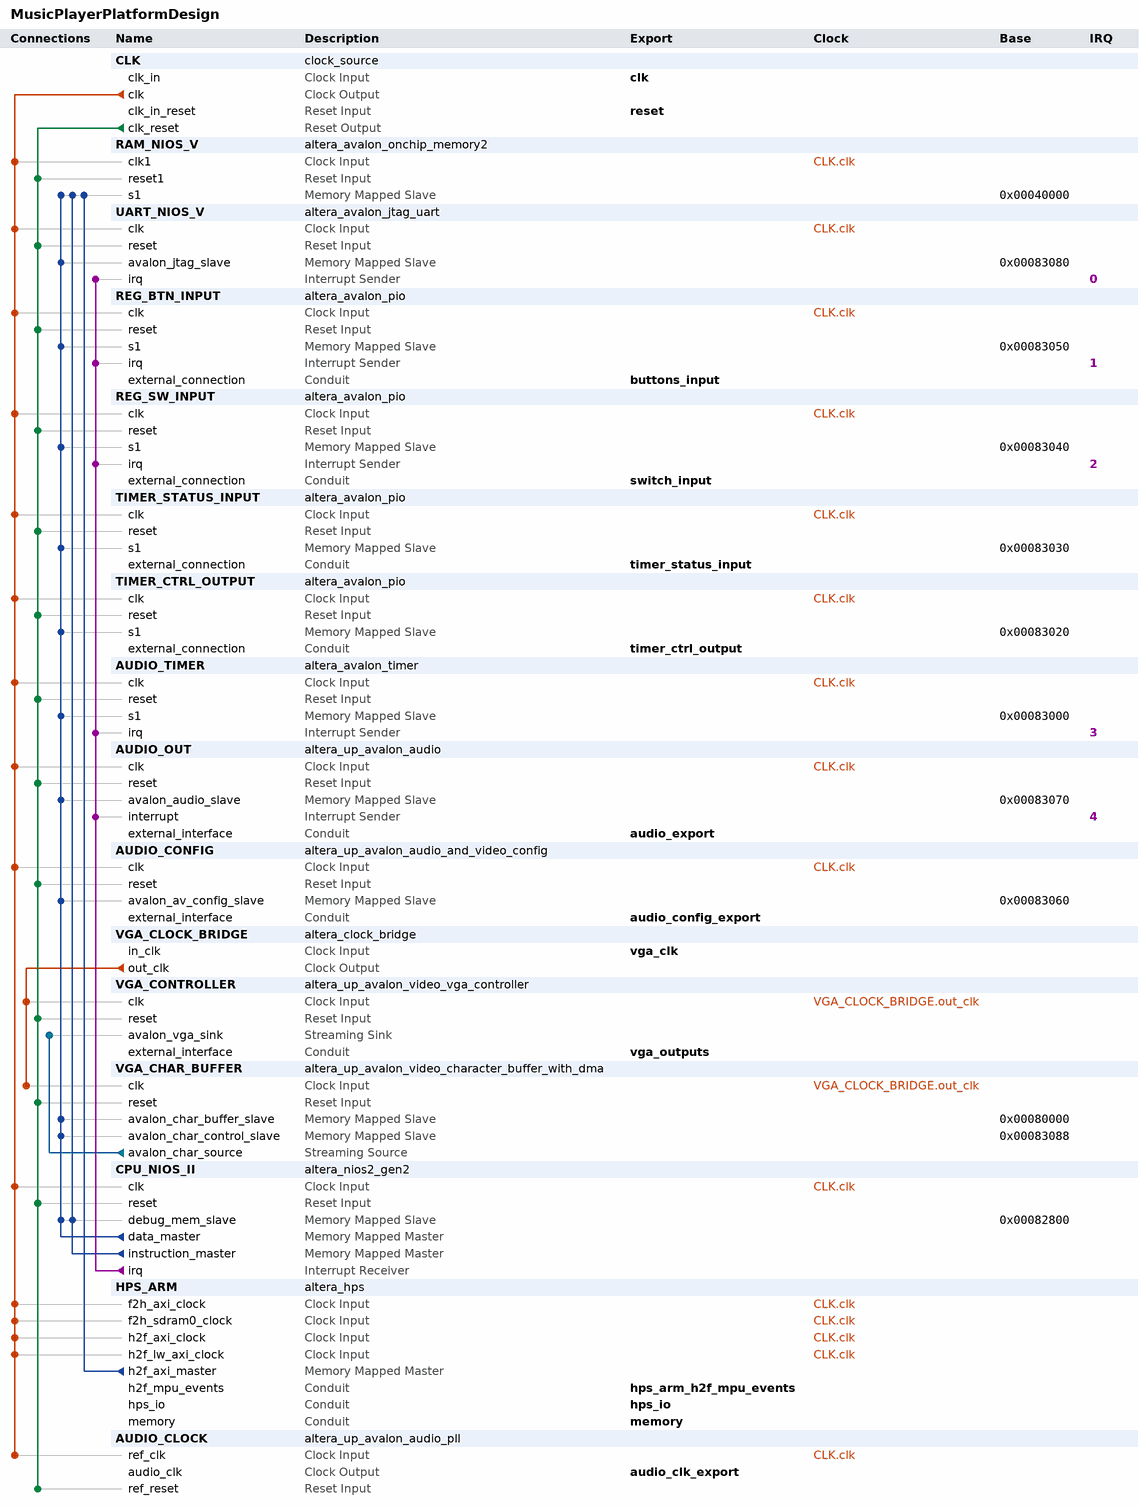
[diagram p0: system contents]
# Platform Designer (Qsys) system MusicPlayerPlatformDesign, Cyclone V 5CSEMA5F31C6
# Parameters at their usual value, and those the tool derives, are not listed.
package require -exact qsys 22.1
create_system MusicPlayerPlatformDesign
set_project_property DEVICE_FAMILY {Cyclone V}
set_project_property DEVICE 5CSEMA5F31C6

add_instance CLK clock_source 22.1
set_instance_parameter_value CLK clockFrequency 50000000

add_instance RAM_NIOS_V altera_avalon_onchip_memory2 22.1
set_instance_parameter_value RAM_NIOS_V dataWidth 32
set_instance_parameter_value RAM_NIOS_V dualPort false
set_instance_parameter_value RAM_NIOS_V initMemContent true
set_instance_parameter_value RAM_NIOS_V initializationFileName onchip_mem.hex
set_instance_parameter_value RAM_NIOS_V memorySize 262144

add_instance UART_NIOS_V altera_avalon_jtag_uart 22.1
set_instance_parameter_value UART_NIOS_V simInteractiveOptions NO_INTERACTIVE_WINDOWS

add_instance REG_BTN_INPUT altera_avalon_pio 22.1
set_instance_parameter_value REG_BTN_INPUT direction Input
set_instance_parameter_value REG_BTN_INPUT generateIRQ true
set_instance_parameter_value REG_BTN_INPUT width 4

add_instance REG_SW_INPUT altera_avalon_pio 22.1
set_instance_parameter_value REG_SW_INPUT direction Input
set_instance_parameter_value REG_SW_INPUT generateIRQ true
set_instance_parameter_value REG_SW_INPUT width 1

add_instance TIMER_STATUS_INPUT altera_avalon_pio 22.1
set_instance_parameter_value TIMER_STATUS_INPUT direction Input
set_instance_parameter_value TIMER_STATUS_INPUT width 2

add_instance TIMER_CTRL_OUTPUT altera_avalon_pio 22.1
set_instance_parameter_value TIMER_CTRL_OUTPUT direction Output
set_instance_parameter_value TIMER_CTRL_OUTPUT width 2

add_instance AUDIO_TIMER altera_avalon_timer 22.1
set_instance_parameter_value AUDIO_TIMER period 1
set_instance_parameter_value AUDIO_TIMER periodUnits MSEC

add_instance AUDIO_OUT altera_up_avalon_audio 18.0
set_instance_parameter_value AUDIO_OUT audio_in false
set_instance_parameter_value AUDIO_OUT avalon_bus_type {Memory Mapped}
set_instance_parameter_value AUDIO_OUT dw 16

add_instance AUDIO_CONFIG altera_up_avalon_audio_and_video_config 18.0
set_instance_parameter_value AUDIO_CONFIG audio_in {Line In to ADC}
set_instance_parameter_value AUDIO_CONFIG bit_length 16
set_instance_parameter_value AUDIO_CONFIG board DE1-SoC
set_instance_parameter_value AUDIO_CONFIG line_in_bypass false
set_instance_parameter_value AUDIO_CONFIG sampling_rate {96 kHz}

add_instance VGA_CLOCK_BRIDGE altera_clock_bridge 22.1
set_instance_parameter_value VGA_CLOCK_BRIDGE DERIVED_CLOCK_RATE 0
set_instance_parameter_value VGA_CLOCK_BRIDGE EXPLICIT_CLOCK_RATE 0

add_instance VGA_CONTROLLER altera_up_avalon_video_vga_controller 18.0
set_instance_parameter_value VGA_CONTROLLER board DE1-SoC
set_instance_parameter_value VGA_CONTROLLER resolution {VGA 640x480}

add_instance VGA_CHAR_BUFFER altera_up_avalon_video_character_buffer_with_dma 18.0
set_instance_parameter_value VGA_CHAR_BUFFER enable_transparency false

add_instance CPU_NIOS_II altera_nios2_gen2 22.1
set_instance_parameter_value CPU_NIOS_II dcache_size 2048
set_instance_parameter_value CPU_NIOS_II exceptionSlave RAM_NIOS_V.s1
set_instance_parameter_value CPU_NIOS_II icache_size 4096
set_instance_parameter_value CPU_NIOS_II impl Tiny
set_instance_parameter_value CPU_NIOS_II resetSlave RAM_NIOS_V.s1

add_instance HPS_ARM altera_hps 22.1
set_instance_parameter_value HPS_ARM EMAC0_Mode RGMII
set_instance_parameter_value HPS_ARM EMAC0_PinMuxing {HPS I/O Set 0}
set_instance_parameter_value HPS_ARM EMAC1_Mode N/A
set_instance_parameter_value HPS_ARM EMAC1_PinMuxing Unused
set_instance_parameter_value HPS_ARM F2SCLK_COLDRST_Enable false
set_instance_parameter_value HPS_ARM F2SCLK_DBGRST_Enable false
set_instance_parameter_value HPS_ARM F2SCLK_WARMRST_Enable false
set_instance_parameter_value HPS_ARM F2SDRAM_Type AXI-3
set_instance_parameter_value HPS_ARM F2SDRAM_Width 64
set_instance_parameter_value HPS_ARM F2SINTERRUPT_Enable false
set_instance_parameter_value HPS_ARM F2S_Width 2
set_instance_parameter_value HPS_ARM FPGA_PERIPHERAL_OUTPUT_CLOCK_FREQ_EMAC0_GTX_CLK 125
set_instance_parameter_value HPS_ARM FPGA_PERIPHERAL_OUTPUT_CLOCK_FREQ_EMAC0_MD_CLK 2.5
set_instance_parameter_value HPS_ARM FPGA_PERIPHERAL_OUTPUT_CLOCK_FREQ_EMAC1_GTX_CLK 125
set_instance_parameter_value HPS_ARM FPGA_PERIPHERAL_OUTPUT_CLOCK_FREQ_EMAC1_MD_CLK 2.5
set_instance_parameter_value HPS_ARM HPS_PROTOCOL DDR3
set_instance_parameter_value HPS_ARM I2C0_Mode N/A
set_instance_parameter_value HPS_ARM I2C0_PinMuxing Unused
set_instance_parameter_value HPS_ARM I2C1_Mode N/A
set_instance_parameter_value HPS_ARM I2C1_PinMuxing Unused
set_instance_parameter_value HPS_ARM LWH2F_Enable true
set_instance_parameter_value HPS_ARM MEM_BANKADDR_WIDTH 3
set_instance_parameter_value HPS_ARM MEM_CLK_FREQ 300.0
set_instance_parameter_value HPS_ARM MEM_CLK_FREQ_MAX 400.0
set_instance_parameter_value HPS_ARM MEM_COL_ADDR_WIDTH 8
set_instance_parameter_value HPS_ARM MEM_DQ_WIDTH 8
set_instance_parameter_value HPS_ARM MEM_DRV_STR RZQ/6
set_instance_parameter_value HPS_ARM MEM_ROW_ADDR_WIDTH 12
set_instance_parameter_value HPS_ARM MEM_RTT_NOM RZQ/4
set_instance_parameter_value HPS_ARM MEM_RTT_WR {Dynamic ODT off}
set_instance_parameter_value HPS_ARM MEM_TCL 7
set_instance_parameter_value HPS_ARM MEM_TFAW_NS 37.5
set_instance_parameter_value HPS_ARM MEM_TINIT_US 499
set_instance_parameter_value HPS_ARM MEM_TMRD_CK 3
set_instance_parameter_value HPS_ARM MEM_TRAS_NS 40.0
set_instance_parameter_value HPS_ARM MEM_TRCD_NS 15.0
set_instance_parameter_value HPS_ARM MEM_TREFI_US 7.0
set_instance_parameter_value HPS_ARM MEM_TRFC_NS 75.0
set_instance_parameter_value HPS_ARM MEM_TRP_NS 15.0
set_instance_parameter_value HPS_ARM MEM_TWTR 2
set_instance_parameter_value HPS_ARM MEM_VENDOR JEDEC
set_instance_parameter_value HPS_ARM MEM_WTCL 6
set_instance_parameter_value HPS_ARM MPU_EVENTS_Enable true
set_instance_parameter_value HPS_ARM QSPI_Mode N/A
set_instance_parameter_value HPS_ARM QSPI_PinMuxing Unused
set_instance_parameter_value HPS_ARM REF_CLK_FREQ 125.0
set_instance_parameter_value HPS_ARM S2FCLK_COLDRST_Enable true
set_instance_parameter_value HPS_ARM S2FCLK_USER2CLK 5
set_instance_parameter_value HPS_ARM S2F_Width 2
set_instance_parameter_value HPS_ARM SDIO_Mode {4-bit Data}
set_instance_parameter_value HPS_ARM SDIO_PinMuxing {HPS I/O Set 0}
set_instance_parameter_value HPS_ARM SPIM1_Mode N/A
set_instance_parameter_value HPS_ARM SPIM1_PinMuxing Unused
set_instance_parameter_value HPS_ARM STM_Enable false
set_instance_parameter_value HPS_ARM TIMING_BOARD_AC_SKEW 0.02
set_instance_parameter_value HPS_ARM TIMING_BOARD_AC_TO_CK_SKEW 0.0
set_instance_parameter_value HPS_ARM TIMING_BOARD_DQ_TO_DQS_SKEW 0.0
set_instance_parameter_value HPS_ARM TIMING_BOARD_MAX_CK_DELAY 0.6
set_instance_parameter_value HPS_ARM TIMING_BOARD_MAX_DQS_DELAY 0.6
set_instance_parameter_value HPS_ARM TIMING_BOARD_SKEW_BETWEEN_DQS 0.02
set_instance_parameter_value HPS_ARM TIMING_BOARD_SKEW_CKDQS_DIMM_MAX 0.01
set_instance_parameter_value HPS_ARM TIMING_BOARD_SKEW_CKDQS_DIMM_MIN -0.01
set_instance_parameter_value HPS_ARM TIMING_BOARD_SKEW_WITHIN_DQS 0.02
set_instance_parameter_value HPS_ARM TIMING_TDH 125
set_instance_parameter_value HPS_ARM TIMING_TDQSCK 400
set_instance_parameter_value HPS_ARM TIMING_TDQSQ 120
set_instance_parameter_value HPS_ARM TIMING_TDS 50
set_instance_parameter_value HPS_ARM TIMING_TIH 250
set_instance_parameter_value HPS_ARM TIMING_TIS 175
set_instance_parameter_value HPS_ARM TIMING_TQSH 0.38
set_instance_parameter_value HPS_ARM UART0_Mode N/A
set_instance_parameter_value HPS_ARM UART0_PinMuxing Unused
set_instance_parameter_value HPS_ARM USB1_Mode N/A
set_instance_parameter_value HPS_ARM USB1_PinMuxing Unused
set_instance_parameter_value HPS_ARM desired_cfg_clk_mhz 100.0
set_instance_parameter_value HPS_ARM desired_qspi_clk_mhz 400.0

add_instance AUDIO_CLOCK altera_up_avalon_audio_pll 18.0
set_instance_parameter_value AUDIO_CLOCK gui_refclk 50.0

# connections
add_connection CLK.clk AUDIO_CLOCK.ref_clk clock
add_connection CLK.clk AUDIO_CONFIG.clk clock
add_connection CLK.clk AUDIO_OUT.clk clock
add_connection CLK.clk AUDIO_TIMER.clk clock
add_connection CLK.clk CPU_NIOS_II.clk clock
add_connection CLK.clk HPS_ARM.f2h_axi_clock clock
add_connection CLK.clk HPS_ARM.f2h_sdram0_clock clock
add_connection CLK.clk HPS_ARM.h2f_axi_clock clock
add_connection CLK.clk HPS_ARM.h2f_lw_axi_clock clock
add_connection CLK.clk RAM_NIOS_V.clk1 clock
add_connection CLK.clk REG_BTN_INPUT.clk clock
add_connection CLK.clk REG_SW_INPUT.clk clock
add_connection CLK.clk TIMER_CTRL_OUTPUT.clk clock
add_connection CLK.clk TIMER_STATUS_INPUT.clk clock
add_connection CLK.clk UART_NIOS_V.clk clock
add_connection VGA_CLOCK_BRIDGE.out_clk VGA_CHAR_BUFFER.clk clock
add_connection VGA_CLOCK_BRIDGE.out_clk VGA_CONTROLLER.clk clock
add_connection CLK.clk_reset AUDIO_CLOCK.ref_reset reset
add_connection CLK.clk_reset AUDIO_CONFIG.reset reset
add_connection CLK.clk_reset AUDIO_OUT.reset reset
add_connection CLK.clk_reset AUDIO_TIMER.reset reset
add_connection CLK.clk_reset CPU_NIOS_II.reset reset
add_connection CLK.clk_reset RAM_NIOS_V.reset1 reset
add_connection CLK.clk_reset REG_BTN_INPUT.reset reset
add_connection CLK.clk_reset REG_SW_INPUT.reset reset
add_connection CLK.clk_reset TIMER_CTRL_OUTPUT.reset reset
add_connection CLK.clk_reset TIMER_STATUS_INPUT.reset reset
add_connection CLK.clk_reset UART_NIOS_V.reset reset
add_connection CLK.clk_reset VGA_CHAR_BUFFER.reset reset
add_connection CLK.clk_reset VGA_CONTROLLER.reset reset
add_connection CPU_NIOS_II.data_master AUDIO_CONFIG.avalon_av_config_slave avalon
set_connection_parameter_value CPU_NIOS_II.data_master/AUDIO_CONFIG.avalon_av_config_slave baseAddress 0x00083060
add_connection CPU_NIOS_II.data_master AUDIO_OUT.avalon_audio_slave avalon
set_connection_parameter_value CPU_NIOS_II.data_master/AUDIO_OUT.avalon_audio_slave baseAddress 0x00083070
add_connection CPU_NIOS_II.data_master AUDIO_TIMER.s1 avalon
set_connection_parameter_value CPU_NIOS_II.data_master/AUDIO_TIMER.s1 baseAddress 0x00083000
add_connection CPU_NIOS_II.data_master CPU_NIOS_II.debug_mem_slave avalon
set_connection_parameter_value CPU_NIOS_II.data_master/CPU_NIOS_II.debug_mem_slave baseAddress 0x00082800
add_connection CPU_NIOS_II.data_master RAM_NIOS_V.s1 avalon
set_connection_parameter_value CPU_NIOS_II.data_master/RAM_NIOS_V.s1 baseAddress 0x00040000
add_connection CPU_NIOS_II.data_master REG_BTN_INPUT.s1 avalon
set_connection_parameter_value CPU_NIOS_II.data_master/REG_BTN_INPUT.s1 baseAddress 0x00083050
add_connection CPU_NIOS_II.data_master REG_SW_INPUT.s1 avalon
set_connection_parameter_value CPU_NIOS_II.data_master/REG_SW_INPUT.s1 baseAddress 0x00083040
add_connection CPU_NIOS_II.data_master TIMER_CTRL_OUTPUT.s1 avalon
set_connection_parameter_value CPU_NIOS_II.data_master/TIMER_CTRL_OUTPUT.s1 baseAddress 0x00083020
add_connection CPU_NIOS_II.data_master TIMER_STATUS_INPUT.s1 avalon
set_connection_parameter_value CPU_NIOS_II.data_master/TIMER_STATUS_INPUT.s1 baseAddress 0x00083030
add_connection CPU_NIOS_II.data_master UART_NIOS_V.avalon_jtag_slave avalon
set_connection_parameter_value CPU_NIOS_II.data_master/UART_NIOS_V.avalon_jtag_slave baseAddress 0x00083080
add_connection CPU_NIOS_II.data_master VGA_CHAR_BUFFER.avalon_char_buffer_slave avalon
set_connection_parameter_value CPU_NIOS_II.data_master/VGA_CHAR_BUFFER.avalon_char_buffer_slave baseAddress 0x00080000
add_connection CPU_NIOS_II.data_master VGA_CHAR_BUFFER.avalon_char_control_slave avalon
set_connection_parameter_value CPU_NIOS_II.data_master/VGA_CHAR_BUFFER.avalon_char_control_slave baseAddress 0x00083088
add_connection CPU_NIOS_II.instruction_master CPU_NIOS_II.debug_mem_slave avalon
set_connection_parameter_value CPU_NIOS_II.instruction_master/CPU_NIOS_II.debug_mem_slave baseAddress 0x00082800
add_connection CPU_NIOS_II.instruction_master RAM_NIOS_V.s1 avalon
set_connection_parameter_value CPU_NIOS_II.instruction_master/RAM_NIOS_V.s1 baseAddress 0x00040000
add_connection HPS_ARM.h2f_axi_master RAM_NIOS_V.s1 avalon
set_connection_parameter_value HPS_ARM.h2f_axi_master/RAM_NIOS_V.s1 baseAddress 0x00040000
add_connection VGA_CHAR_BUFFER.avalon_char_source VGA_CONTROLLER.avalon_vga_sink avalon_streaming
add_connection CPU_NIOS_II.irq AUDIO_OUT.interrupt interrupt
set_connection_parameter_value CPU_NIOS_II.irq/AUDIO_OUT.interrupt irqNumber 4
add_connection CPU_NIOS_II.irq AUDIO_TIMER.irq interrupt
set_connection_parameter_value CPU_NIOS_II.irq/AUDIO_TIMER.irq irqNumber 3
add_connection CPU_NIOS_II.irq REG_BTN_INPUT.irq interrupt
set_connection_parameter_value CPU_NIOS_II.irq/REG_BTN_INPUT.irq irqNumber 1
add_connection CPU_NIOS_II.irq REG_SW_INPUT.irq interrupt
set_connection_parameter_value CPU_NIOS_II.irq/REG_SW_INPUT.irq irqNumber 2
add_connection CPU_NIOS_II.irq UART_NIOS_V.irq interrupt
set_connection_parameter_value CPU_NIOS_II.irq/UART_NIOS_V.irq irqNumber 0

# exported interfaces
add_interface audio_clk_export clock source
set_interface_property audio_clk_export EXPORT_OF AUDIO_CLOCK.audio_clk
add_interface audio_config_export conduit end
set_interface_property audio_config_export EXPORT_OF AUDIO_CONFIG.external_interface
add_interface audio_export conduit end
set_interface_property audio_export EXPORT_OF AUDIO_OUT.external_interface
add_interface buttons_input conduit end
set_interface_property buttons_input EXPORT_OF REG_BTN_INPUT.external_connection
add_interface clk clock sink
set_interface_property clk EXPORT_OF CLK.clk_in
add_interface hps_arm_h2f_mpu_events conduit end
set_interface_property hps_arm_h2f_mpu_events EXPORT_OF HPS_ARM.h2f_mpu_events
add_interface hps_io conduit end
set_interface_property hps_io EXPORT_OF HPS_ARM.hps_io
add_interface memory conduit end
set_interface_property memory EXPORT_OF HPS_ARM.memory
add_interface reset reset sink
set_interface_property reset EXPORT_OF CLK.clk_in_reset
add_interface switch_input conduit end
set_interface_property switch_input EXPORT_OF REG_SW_INPUT.external_connection
add_interface timer_ctrl_output conduit end
set_interface_property timer_ctrl_output EXPORT_OF TIMER_CTRL_OUTPUT.external_connection
add_interface timer_status_input conduit end
set_interface_property timer_status_input EXPORT_OF TIMER_STATUS_INPUT.external_connection
add_interface vga_clk clock sink
set_interface_property vga_clk EXPORT_OF VGA_CLOCK_BRIDGE.in_clk
add_interface vga_outputs conduit end
set_interface_property vga_outputs EXPORT_OF VGA_CONTROLLER.external_interface

set_interconnect_requirement {$system} qsys_mm.clockCrossingAdapter HANDSHAKE
set_interconnect_requirement {$system} qsys_mm.enableEccProtection FALSE
set_interconnect_requirement {$system} qsys_mm.insertDefaultSlave FALSE
set_interconnect_requirement {$system} qsys_mm.maxAdditionalLatency 1

save_system MusicPlayerPlatformDesign.qsys
